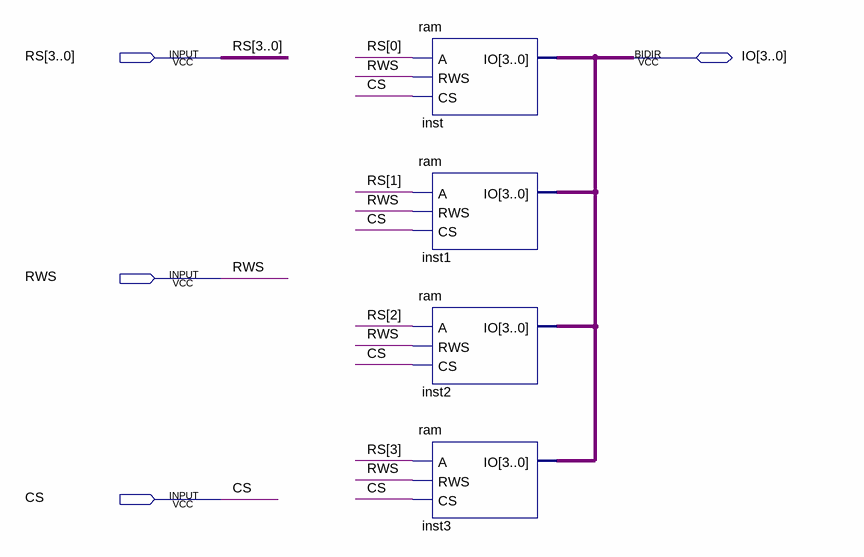
[diagram p0: schematic sheet]
// Quartus schematic ram4x4.bdf as structural Verilog: 4 symbols, 4 pins
module ram4x4 (
  input  [3:0] RS,
  input  RWS,
  input  CS,
  inout  [3:0] IO
);

  ram inst (.A(RS[0]), .RWS(RWS), .CS(CS), .IO(IO));
  ram inst1 (.A(RS[1]), .RWS(RWS), .CS(CS), .IO(IO));
  ram inst2 (.A(RS[2]), .RWS(RWS), .CS(CS), .IO(IO));
  ram inst3 (.A(RS[3]), .RWS(RWS), .CS(CS), .IO(IO));
endmodule
